# Altium project ASR_USB.PrjPcb
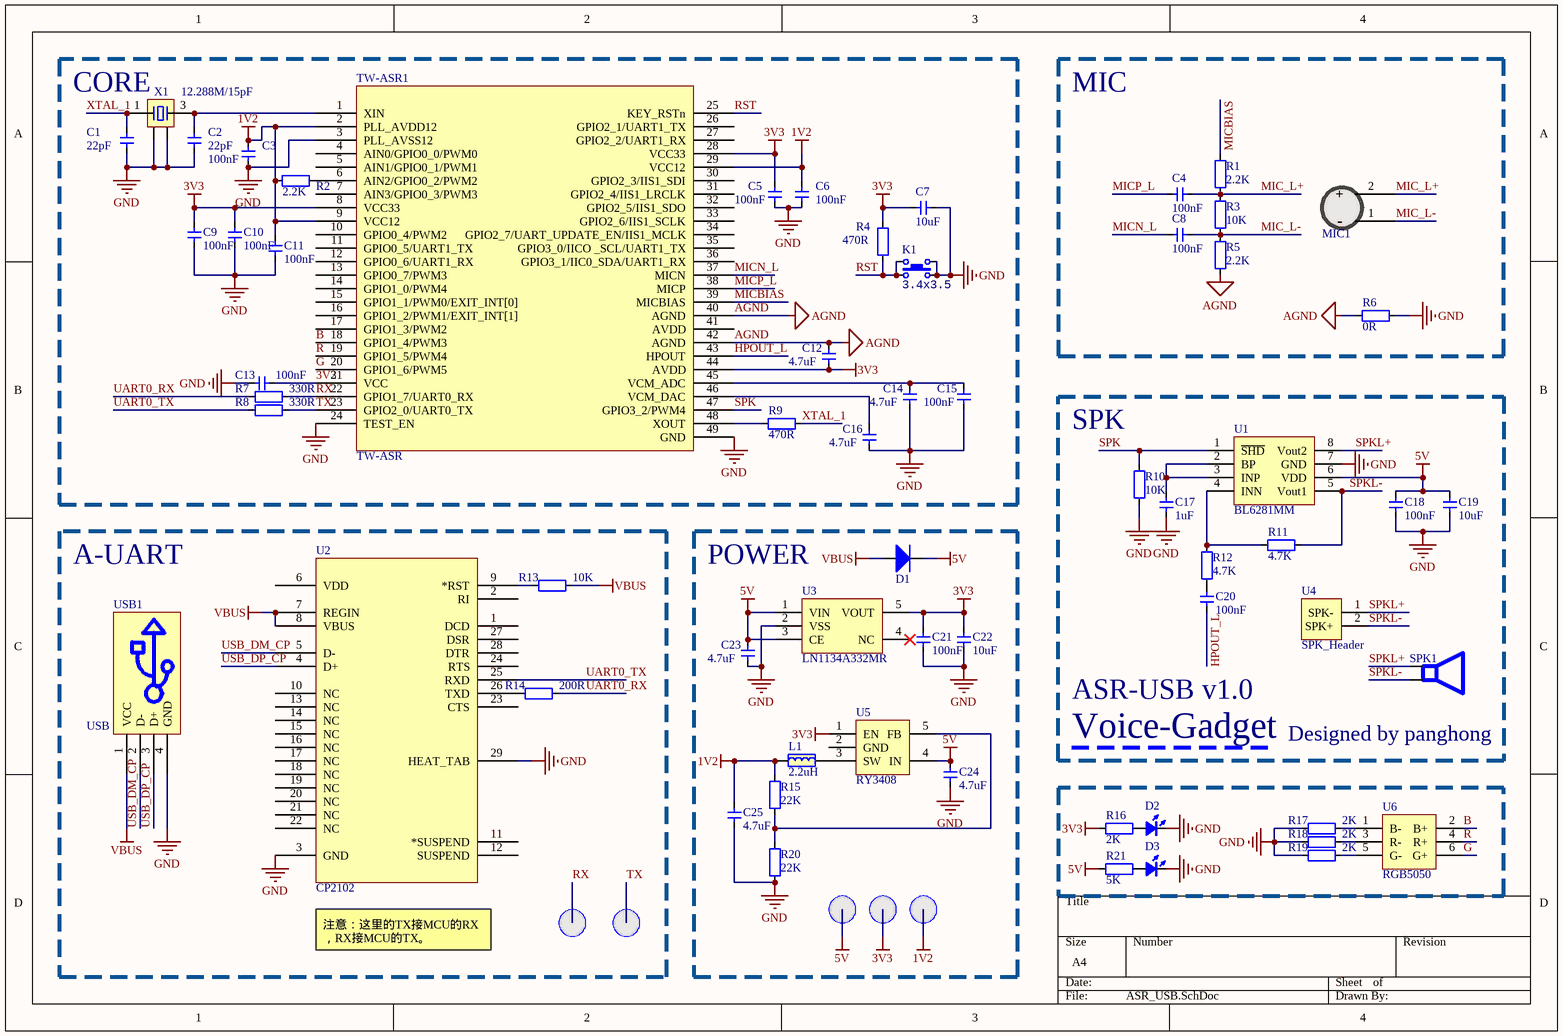
[diagram p0: ASR_USB.SchDoc]
1 sheet, 67 parts. Net scope: global (net labels, ports and power ports of the same name join across sheets).
Board file: ASR_USB.PcbDoc

## Sheet ASR_USB.SchDoc
size A4; SheetNumber: 1; SheetTotal: 1

### Parts
C1  22pF  [CAP_0402]
C2  22pF  [CAP_0402]
C3  100nF  [CAP_0402]
C4  100nF  [CAP_0402]
C5  100nF  [CAP_0402]
C6  100nF  [CAP_0402]
C7  10uF  [CAP_0402]
C8  100nF  [CAP_0402]
C9  100nF  [CAP_0402]
C10  100nF  [CAP_0402]
C11  100nF  [CAP_0402]
C12  4.7uF  [CAP_0402]
C13  100nF  [CAP_0402]
C14  4.7uF  [CAP_0402]
C15  100nF  [CAP_0402]
C16  4.7uF  [CAP_0402]
C17  1uF  [CAP_0402]
C18  100nF  [CAP_0402]
C19  10uF  [CAP_0402]
C20  100nF  [CAP_0402]
C21  100nF  [CAP_0402]
C22  10uF  [CAP_0402]
C23  4.7uF  [CAP_0402]
C24  4.7uF  [CAP_0402]
C25  4.7uF  [CAP_0402]
D1  二极管-5819W  [SOD-323]  (value not drawn)
D2  color?  [LED_0402_RED]  (value not drawn)
D3  color?  [LED_0402_RED]  (value not drawn)
K1  value 3.4x3.5  [ButtonTACT_3.5*3.55_90]  (hidden comment: TACT 4P)
L1  2.2uH  [2520-L]
MIC1  MIC  [MIC-SMT]  (value not drawn)
R1  2.2K  [RES_0402]
R2  2.2K  [RES_0402]
R3  10K  [RES_0402]
R4  470R  [RES_0402]
R5  2.2K  [RES_0402]
R6  0R  [RES_0402]
R7  330R  [RES_0402]
R8  330R  [RES_0402]
R9  470R  [RES_0402]
R10  10K  [RES_0402]
R11  4.7K  [RES_0402]
R12  4.7K  [RES_0402]
R13  10K  [RES_0402]
R14  200R  [RES_0402]
R15  22K  [RES_0402]
R16  2K  [RES_0402]
R17  2K  [RES_0402]
R18  2K  [RES_0402]
R19  2K  [RES_0402]
R20  22K  [RES_0402]
R21  5K  [RES_0402]
SPK1  SPK  [SPK]  (value not drawn)
T1  测试点  [TEST_PT]  (value not drawn)
T2  测试点  [TEST_PT]  (value not drawn)
T3  测试点  [TEST_PT]  (value not drawn)
T4  LinkPoint  [TEST_PT_Point]  (value not drawn)
T5  LinkPoint  [TEST_PT_Point]  (value not drawn)
TW-ASR1  TW-ASR  [QFN48 7X7_L]
U1  BL6281MM  [MSOP8_M]
U2  CP2102  [QFN-28]
U3  LN1134A332MR  [SOT23-5]
U4  SPK_Header  [SPK_Header]
U5  RY3408  [SOT23-5]
U6  RGB5050  [RGB5050]
USB1  USB  [USB-plug1]
X1  12.288M/15pF  [OSC 3225-4P]

### Blocks framed on the sheet
CORE: C1-C3 C5-C7 C9-C16 K1 R2 R4 R7-R9 TW-ASR1 X1
MIC: C4 C8 MIC1 R1 R3 R5 R6
Voice-Gadget: C17-C20 R10-R12 SPK1 U1 U4
A-UART: R13 R14 T4 T5 U2 USB1
POWER: C21-C25 D1 L1 R15 R20 T1-T3 U3 U5

### Nets
1V2: C3.2 C6.2 C11.1 C25.1 L1.1 R2.1 R15.2 T3.0 TW-ASR1.2(PLL_AVDD12) TW-ASR1.9(VCC12) TW-ASR1.29(VCC12)
3V3: C5.2 C7.2 C9.1 C10.1 C12.1 C13.1 C21.1 C22.1 R4.2 R16.2 T2.0 TW-ASR1.8(VCC33) TW-ASR1.21(VCC) TW-ASR1.28(VCC33) TW-ASR1.44(AVDD) U3.5(VOUT) U5.1(EN)
5V: C18.1 C19.1 C23.2 C24.1 D1.2(K) R21.2 T1.0 U1.6(VDD) U3.1(VIN) U3.3(CE) U5.4(IN)
AGND: C12.2 R5.1 R6.2 TW-ASR1.40(AGND) TW-ASR1.42(AGND)
GND: C1.1 C2.1 C3.1 C5.1 C6.1 C7.1 C9.2 C10.2 C11.2 C13.2 C14.1 C15.1 C16.1 C17.2 C18.2 C19.2 C21.2 C22.2 C23.1 C24.2 C25.2 D2.2(K) D3.2(K) K1.2 K1.4 R6.1 R10.1 R17.2 R18.2 R19.2 R20.1 TW-ASR1.3(PLL_AVSS12) TW-ASR1.24(TEST_EN) TW-ASR1.49(GND) U1.7(GND) U2.3(GND) U2.29(HEAT_TAB) U3.2(VSS) USB1.4(GND) X1.2 X1.4
VBUS: D1.1(A) R13.2 U2.7(REGIN) U2.8(VBUS) USB1.1(VCC)
B: TW-ASR1.18(GPIO1_4/PWM3) U6.2(B+)
G: TW-ASR1.20(GPIO1_6/PWM5) U6.6(G+)
HPOUT_L: C20.2 TW-ASR1.43(HPOUT)
MIC_L+: C4.1 MIC1.2(+) R1.1 R3.2
MIC_L-: C8.1 MIC1.1(-) R3.1 R5.2
MICBIAS: R1.2 TW-ASR1.39(MICBIAS)
MICN_L: C8.2 TW-ASR1.37(MICN)
MICP_L: C4.2 TW-ASR1.38(MICP)
R: TW-ASR1.19(GPIO1_5/PWM4) U6.4(R+)
RST: K1.1 K1.3 R4.1 TW-ASR1.25(KEY_RSTn)
RX: R7.2 T4.0 TW-ASR1.22(GPIO1_7/UART0_RX)
SPK: R10.2 TW-ASR1.47(GPIO3_2/PWM4) U1.1(~{SHD})
SPKL+: SPK1.1 U1.8(Vout2) U4.1(SPK-)
SPKL-: R11.1 SPK1.2 U1.5(Vout1) U4.2(SPK+)
TX: R8.2 T5.0 TW-ASR1.23(GPIO2_0/UART0_TX)
UART0_RX: R7.1 R14.2
UART0_TX: R8.1 U2.25(RXD)
USB_DM_CP: U2.5(D-) USB1.2(D-)
USB_DP_CP: U2.4(D+) USB1.3(D+)
XTAL_1: C1.2 R9.2 X1.1
NetC2_2: C2.2 TW-ASR1.1(XIN) X1.3
NetC14_2: C14.2 C15.2 TW-ASR1.45(VCM_ADC)
NetC16_2: C16.2 TW-ASR1.46(VCM_DAC)
NetC17_1: C17.1 U1.2(BP) U1.3(INP)
NetC20_1: C20.1 R12.1
NetD2_1: D2.1(A) R16.1
NetD3_1: D3.1(A) R21.1
NetL1_2: L1.2 U5.3(SW)
NetR2_2: R2.2 TW-ASR1.6(AIN2/GPIO0_2/PWM2)
NetR9_1: R9.1 TW-ASR1.48(XOUT)
NetR11_2: R11.2 R12.2 U1.4(INN)
NetR13_1: R13.1 U2.9(*RST)
NetR14_1: R14.1 U2.26(TXD)
NetR15_1: R15.1 R20.2 U5.5(FB)
NetR17_1: R17.1 U6.1(B-)
NetR18_1: R18.1 U6.3(R-)
NetR19_1: R19.1 U6.5(G-)

Not connected (* = marked no-connect by the designer): TW-ASR1 4(AIN0/GPIO0_0/PWM0) 5(AIN1/GPIO0_1/PWM1) 7(AIN3/GPIO0_3/PWM3) 10(GPIO0_4/PWM2) 11(GPIO0_5/UART1_TX) 12(GPIO0_6/UART1_RX) 13(GPIO0_7/PWM3) 14(GPIO1_0/PWM4) 15(GPIO1_1/PWM0/EXIT_INT[0]) 16(GPIO1_2/PWM1/EXIT_INT[1]) 17(GPIO1_3/PWM2) 26(GPIO2_1/UART1_TX) 27(GPIO2_2/UART1_RX) 30(GPIO2_3/IIS1_SDI) 31(GPIO2_4/IIS1_LRCLK) 32(GPIO2_5/IIS1_SDO) 33(GPIO2_6/IIS1_SCLK) 34(GPIO2_7/UART_UPDATE_EN/IIS1_MCLK) 35(GPIO3_0/IICO__SCL/UART1_TX) 36(GPIO3_1/IIC0_SDA/UART1_RX) 41(AVDD); U2 1(DCD) 2(RI) 6(VDD) 10(NC) 11(*SUSPEND) 12(SUSPEND) 13(NC) 14(NC) 15(NC) 16(NC) 17(NC) 18(NC) 19(NC) 20(NC) 21(NC) 22(NC) 23(CTS) 24(RTS) 27(DSR) 28(DTR); U3 4(NC)*; U5 2(GND)

### Notes on the sheet
- (near R10) SPK
- ASR-USB v1.0
- (near SPK1) Designed by panghong
- 注意：这里的TX接MCU的RX，RX接MCU的TX。

### Library data of the parts
C1-C25 = CAP-0402: Capacitor; Value: 0.1u
D1 = 二极管-5819W: 40V
D2 D3 = LED_0402: LED; Type: 0402; Value: color?
K1 = ButtonTACT: Button; type: TACT 4P
L1 = 电感-2520: 磁珠
R1-R21 = RES-0402: Resistor; Value: 22R
SPK1 = 扬声器(喇叭)
U2 = CP2102: USB转TTL; PART DESC: SINGLE-CHIP USB TO UART BRIDGE, QFN28, RoHS.; MFG #1: SILICON LABS; PART NUMBER: CP2102; Value: Value; RefDes: RefDes; Type: DEV
USB1 = USB公头
X1 = XTAL-4P: 4脚无源晶振; 版权归属: 封装库来自淘宝卖家 ID：黄晶宝石; BOM名称: 4脚无源晶振; 学习资源: https://shop463601444.taobao.com